# Altium schematic sheet schematic.SchDoc
size A; SheetNumber: 1; SheetTotal: 7
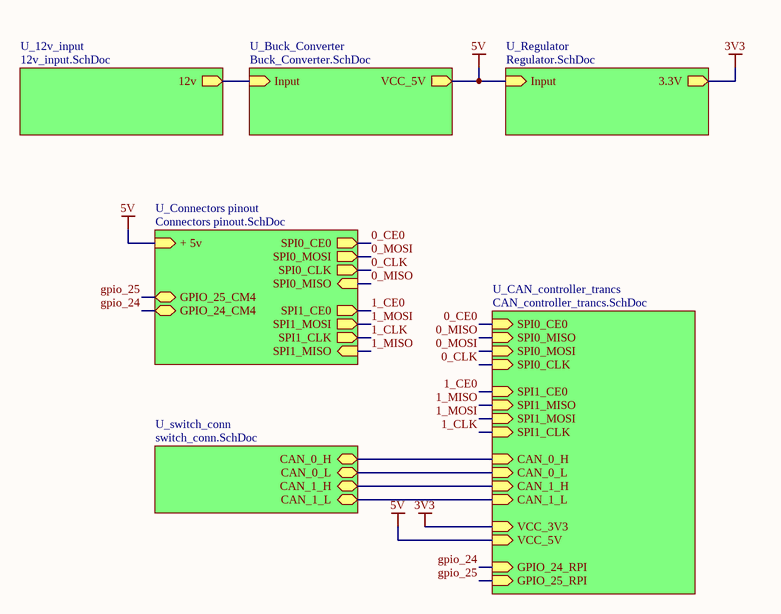
[diagram p0: schematic.SchDoc]

## Sub-sheets
U_12v_input = 12v_input.SchDoc: 12v (out)
U_Buck_Converter = Buck_Converter.SchDoc: Input (in), VCC_5V (out)
U_CAN_controller_trancs = CAN_controller_trancs.SchDoc: SPI0_CE0 (in), SPI0_MISO (in), SPI0_MOSI (in), SPI0_CLK (in), SPI1_CE0 (in), SPI1_MISO (in), SPI1_MOSI (in), SPI1_CLK (in), GPIO_25_RPI (in), CAN_0_H (in), CAN_0_L (in), CAN_1_H (in), CAN_1_L (in), GPIO_24_RPI (in), VCC_3V3 (in), VCC_5V (in)
U_Connectors pinout = Connectors pinout.SchDoc: + 5v (in), SPI0_CE0 (out), SPI1_CE0 (out), SPI1_MISO (in), SPI1_MOSI (out), SPI1_CLK (out), SPI0_MOSI (out), SPI0_CLK (out), SPI0_MISO (in), GPIO_25_CM4 (bidir), GPIO_24_CM4 (bidir)
U_Regulator = Regulator.SchDoc: Input (in), 3.3V (out)
U_switch_conn = switch_conn.SchDoc: CAN_0_H (bidir), CAN_0_L (bidir), CAN_1_H (bidir), CAN_1_L (bidir)

## Nets
3V3: sheet U_Regulator/3.3V, sheet U_CAN_controller_trancs/VCC_3V3
5V: sheet U_Buck_Converter/VCC_5V, sheet U_Regulator/Input, sheet U_CAN_controller_trancs/VCC_5V, sheet U_Connectors pinout/+ 5v
0_CE0: sheet U_CAN_controller_trancs/SPI0_CE0, sheet U_Connectors pinout/SPI0_CE0
0_CLK: sheet U_CAN_controller_trancs/SPI0_CLK, sheet U_Connectors pinout/SPI0_CLK
0_MISO: sheet U_CAN_controller_trancs/SPI0_MISO, sheet U_Connectors pinout/SPI0_MISO
0_MOSI: sheet U_CAN_controller_trancs/SPI0_MOSI, sheet U_Connectors pinout/SPI0_MOSI
1_CE0: sheet U_CAN_controller_trancs/SPI1_CE0, sheet U_Connectors pinout/SPI1_CE0
1_CLK: sheet U_CAN_controller_trancs/SPI1_CLK, sheet U_Connectors pinout/SPI1_CLK
1_MISO: sheet U_CAN_controller_trancs/SPI1_MISO, sheet U_Connectors pinout/SPI1_MISO
1_MOSI: sheet U_CAN_controller_trancs/SPI1_MOSI, sheet U_Connectors pinout/SPI1_MOSI
gpio_24: sheet U_CAN_controller_trancs/GPIO_24_RPI, sheet U_Connectors pinout/GPIO_24_CM4
gpio_25: sheet U_CAN_controller_trancs/GPIO_25_RPI, sheet U_Connectors pinout/GPIO_25_CM4
(unnamed): sheet U_Buck_Converter/Input, sheet U_12v_input/12v
(unnamed): sheet U_switch_conn/CAN_0_H, sheet U_CAN_controller_trancs/CAN_0_H
(unnamed): sheet U_switch_conn/CAN_0_L, sheet U_CAN_controller_trancs/CAN_0_L
(unnamed): sheet U_switch_conn/CAN_1_H, sheet U_CAN_controller_trancs/CAN_1_H
(unnamed): sheet U_switch_conn/CAN_1_L, sheet U_CAN_controller_trancs/CAN_1_L